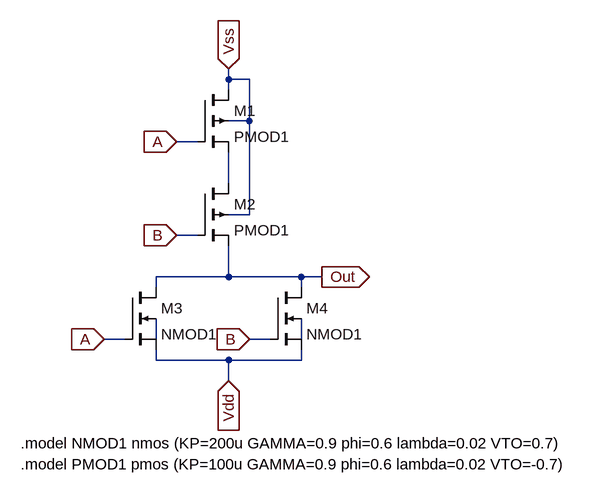
[diagram p0: schematic CMOS_NOR.asc]
CMOS_NOR.asc, the LTspice schematic file:
Version 4
SHEET 1 880 680
WIRE 208 48 208 32
WIRE 240 48 208 48
WIRE 208 64 208 48
WIRE 240 112 240 48
WIRE 240 112 208 112
WIRE 160 144 128 144
WIRE 208 208 208 160
WIRE 240 256 240 112
WIRE 240 256 208 256
WIRE 160 288 128 288
WIRE 208 352 208 304
WIRE 208 352 96 352
WIRE 320 352 208 352
WIRE 352 352 320 352
WIRE 96 368 96 352
WIRE 320 368 320 352
WIRE 48 448 16 448
WIRE 96 448 96 416
WIRE 272 448 240 448
WIRE 320 448 320 416
WIRE 96 480 96 464
WIRE 208 480 96 480
WIRE 320 480 320 464
WIRE 320 480 208 480
WIRE 208 512 208 480
FLAG 208 32 Vss
IOPIN 208 32 In
FLAG 208 512 Vdd
IOPIN 208 512 In
FLAG 16 448 A
IOPIN 16 448 In
FLAG 128 144 A
IOPIN 128 144 In
FLAG 240 448 B
IOPIN 240 448 In
FLAG 128 288 B
IOPIN 128 288 In
FLAG 352 352 Out
IOPIN 352 352 Out
SYMBOL nmos4 48 368 R0
SYMATTR InstName M3
SYMATTR Value NMOD1
SYMATTR Value2 l=1u w=25u
SYMBOL nmos4 272 368 R0
SYMATTR InstName M4
SYMATTR Value NMOD1
SYMATTR Value2 l=1u w=25u
SYMBOL pmos4 160 64 R0
SYMATTR InstName M1
SYMATTR Value PMOD1
SYMATTR Value2 l=1u w=100u
SYMBOL pmos4 160 208 R0
SYMATTR InstName M2
SYMATTR Value PMOD1
SYMATTR Value2 l=1u w=100u
TEXT -112 640 Left 2 !.model PMOD1 pmos (KP=100u GAMMA=0.9 phi=0.6 lambda=0.02 VTO=-0.7)
TEXT -112 608 Left 2 !.model NMOD1 nmos (KP=200u GAMMA=0.9 phi=0.6 lambda=0.02 VTO=0.7)

The netlist it stands for:
* CMOS_NOR.asc
M3 Out A Vdd N002 NMOD1 l=1u w=25u
M4 Out B Vdd N003 NMOD1 l=1u w=25u
M1 Vss A N001 Vss PMOD1 l=1u w=100u
M2 N001 B Out Vss PMOD1 l=1u w=100u
.model NMOS NMOS
.model PMOS PMOS
.lib standard.mos
.model PMOD1 pmos (KP=100u GAMMA=0.9 phi=0.6 lambda=0.02 VTO=-0.7)
.model NMOD1 nmos (KP=200u GAMMA=0.9 phi=0.6 lambda=0.02 VTO=0.7)
.backanno
.end